# EAGLE board BLE_POV_Display_v2.1 (EAGLE 9.6.2)
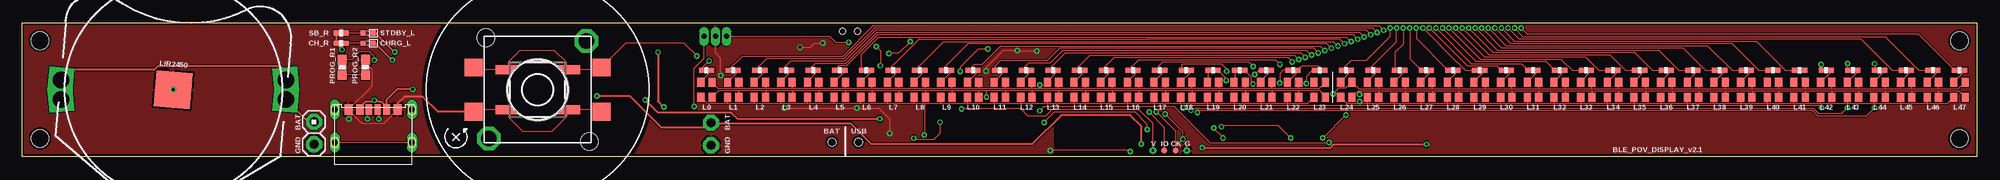
[diagram p2: board, top side]
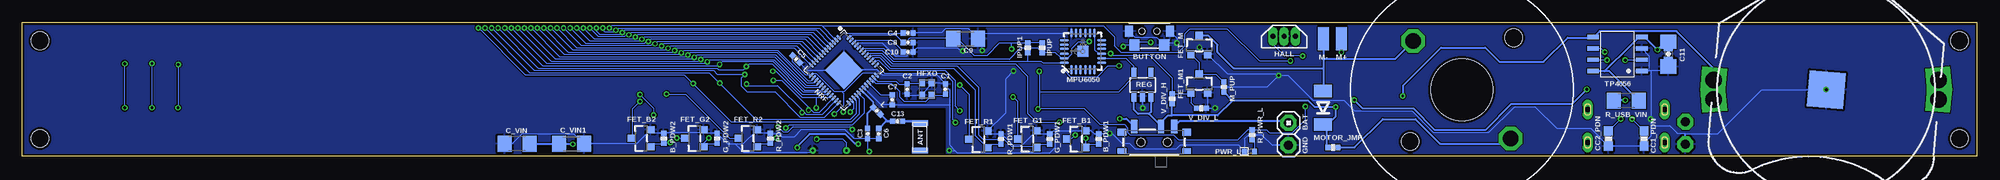
[diagram p3: board, bottom side, seen from below]

Size 220 x 15 mm. Coordinates in mm from the lower left corner, seen from the top.
Outline: 220,0 220,15 0,15 0,0 220,0
Copper layers (1*16): Top 0.035mm / dielectric 1.5mm / Bottom 0.035mm
Design rules "SeeedStudio_2layer_DRU_no_angle_20140221 *": minimum track width 5mil, minimum drill 12mil, track to track 5mil, track to pad 5mil, pad to pad 5mil, via to via 5mil, smd to smd 0mil, copper to edge 10mil, drill to drill 10mil, minimum pad ring 10mil, minimum via ring 6mil, stop-mask expansion 2mil, vias tented up to drill 100mil, thermal gap 10mil
Net classes: 1 pwr: width 0.203 mm
Holes 2 mm at 218,2 218,13 2,13 2,2
tRestrict: area 116.1,0.1 to 126.3,5.4; area 51,0.5 to 65,14.5
bRestrict: area 116.2,0.1 to 126.3,5.4

## Footprints (pad centres in the part's own frame; a part is rotated, then mirrored left to right if it is on the bottom)
CR2477_PTH = smd 4.064 x 4.064: GND 0,0 | drill 1.854 square: V+1 -12.7,0; V+2 12.7,0
ANT3216LL00R2400A = smd 1.8 x 0.6: P1 0,1.55; P2 0,-1.55
0402-RES = smd 0.6 x 0.6: 1 -0.55,0; 2 0.55,0
1X02 = drill 1.016 pad 1.778 octagon: 1 -1.27,0; 2 1.27,0
2X4X3.5MM = smd 1.15 x 1.3: 1 -1.675,-1.55; 2 1.675,-1.55 | smd 0.9 x 1.2: GND -2.3,0; GND2 2.3,0 | hole 0.7: -0.85,0; 0.85,0
0402-CAP = smd 0.6 x 0.6: 1 -0.55,0; 2 0.55,0
1206 = smd 1.6 x 1.8: 1 -1.4,0; 2 1.4,0
0603|1206 = smd 1.1 x 1: 1 -0.85,0; 2 0.85,0 | smd 1.6 x 1.8: P$1 -1.4,0; P$2 1.4,0
0603-RES = smd 1.1 x 1: 1 -0.85,0; 2 0.85,0
0402 = smd 0.6 x 0.6: A -0.55,0; C 0.55,0
SOT23-3 = smd 0.8 x 0.9: 1 -0.95,-1; 2 0.95,-1; 3 0,1.1
TO92_HALLSENSOR = drill 0.55 pad 1.016 long: GND 0,0; OUT -1.27,0; VCC 1.27,0
XTAL_CX2016DB16000D0WZRC1 = smd 0.8 x 0.7: 1 -0.7,-0.55; 2 0.7,-0.55; 3 0.7,0.55; 4 -0.7,0.55
0402' = smd 0.6 x 0.6: 1 -0.55,0; 2 0.55,0
0606 = smd 1 x 0.8: 1 -0.85,0.635; 2 0.85,0.635; 3 0.85,-0.635; 4 -0.85,-0.635
PAD_50X100MIL = smd 1.27 x 2.54: P$1 0,0
QFN-24-EP = smd 1.016 x 0.254: 1 -2.066,1.257; 2 -2.066,0.75; 3 -2.066,0.247; 4 -2.066,-0.287; 5 -2.066,-0.792; 6 -2.066,-1.297; 13 2.086,-1.297; 14 2.086,-0.792; 15 2.086,-0.287; 16 2.086,0.247; 17 2.086,0.75; 18 2.086,1.257 | smd 0.254 x 1.016: 7 -1.267,-2.122; 8 -0.762,-2.122; 9 -0.258,-2.122; 10 0.278,-2.122; 11 0.78,-2.122; 12 1.287,-2.122; 19 1.287,2.082; 20 0.78,2.082; 21 0.278,2.082; 22 -0.258,2.082; 23 -0.762,2.082; 24 -1.267,2.082 | smd 1.27 x 1.27: P$1 0.02,-0.01
NRF52810_QFN40P600X600X90-48_N_3MMTHERMAL = smd 0.65 x 0.2: 1 -3,2.2; 2 -3,1.8; 3 -3,1.4; 4 -3,1; 5 -3,0.6; 6 -3,0.2; 7 -3,-0.2; 8 -3,-0.6; 9 -3,-1; 10 -3,-1.4; 11 -3,-1.8; 12 -3,-2.2; 25 3,-2.2; 26 3,-1.8; 27 3,-1.4; 28 3,-1; 29 3,-0.6; 30 3,-0.2; 31 3,0.2; 32 3,0.6; 33 3,1; 34 3,1.4; 35 3,1.8; 36 3,2.2 | smd 0.2 x 0.65: 13 -2.2,-3; 14 -1.8,-3; 15 -1.4,-3; 16 -1,-3; 17 -0.6,-3; 18 -0.2,-3; 19 0.2,-3; 20 0.6,-3; 21 1,-3; 22 1.4,-3; 23 1.8,-3; 24 2.2,-3; 37 2.2,3; 38 1.8,3; 39 1.4,3; 40 1,3; 41 0.6,3; 42 0.2,3; 43 -0.2,3; 44 -0.6,3; 45 -1,3; 46 -1.4,3; 47 -1.8,3; 48 -2.2,3 | smd 3 x 3: PAD 0,0
SOT23-5 = smd 0.55 x 1.2: 1 -0.95,-1.3; 2 0,-1.3; 3 0.95,-1.3; 4 0.95,1.3; 5 -0.95,1.3
12X12MM_SMD_BT = smd 2 x 2: P$1 -7.2,2.5; P$2 7.2,2.5; P$3 -7.2,-2.5; P$4 7.2,-2.5
DTS-6_SMD = smd 3 x 1: 1 -3.25,2.25; 2 3.25,2.25; 3 -3.25,-2.25; 4 3.25,-2.25
SOP8 = smd 1.3 x 0.5: P$1 -2.75,1.905; P$2 -2.75,0.635; P$3 -2.75,-0.635; P$4 -2.75,-1.905; P$5 2.75,-1.905; P$6 2.75,-0.635; P$7 2.75,0.635; P$8 2.75,1.905
GV_SWD_1.27MM_4P_SEMI_SMD = drill 0.25 pad 0.7: GND 1.905,0; VCC -1.905,0 | smd 0.7 x 0.7: SWDCLK 0.635,0; SWDIO -0.635,0
SOD-80 = smd 1.4 x 2: + 1.87,0; - -1.87,0
SMD_SWITCH = smd 0.7 x 1.5: 1 -2.25,-1.75; 2 -0.75,-1.75; 3 2.25,-1.75 | smd 1 x 0.6: GND1 -3.65,1; GND3 3.65,1 | smd 1 x 0.8: GND2 -3.65,-1.1; GND4 3.65,-1.1 | hole 0.9: -1.5,0; 1.5,0
USCX-06FX-XXMX-01 = smd 0.7 x 1.2: CC1 0.5,-1.75; CC2 -0.5,-1.75 | smd 0.9 x 1.2: GND1 2.75,-1.75; GND2 -2.75,-1.75 | drill 0.6 long: SHIELD1 4.325,1.95; SHIELD2 4.325,-1.75; SHIELD3 -4.35,-1.75; SHIELD4 -4.35,1.95 | smd 0.8 x 1.2: VBUS1 1.5,-1.75; VBUS2 -1.5,-1.75
MOTOR-24.5_HOLES = hole 7: 0,0 | hole 2: -8.25,0; 8.25,0
MOTOR-24.5X12.3 = drill 1.75 pad 2.5 octagon: + -7.75,0; - 7.75,0 | hole 7: 0,0

## Placement (x,y rotation side)
1  CR2477  [CR2477_PTH]  17,7.5 175 bottom
ANT  ANT3216LL00R2400A  [ANT3216LL00R2400A]  119,2.19 0 bottom
B_PDW1  100k  [0402-RES]  98.86,1.95 90 bottom
B_PDW2  100k  [0402-RES]  147.82,2.03 90 bottom
BAT1  PINH1X02  [1X02]  77.5,2.5 90 bottom
BAT2  PINH1X02  [1X02]  32.84,2.61 90 top
BUTTON  PUSHBUTTON_2X4X3.5  [2X4X3.5MM]  93.16,14.07 0 bottom
C1  12pF  [0402-CAP]  116.11,7.57 270 bottom
C2  12pF  [0402-CAP]  120.43,7.57 90 bottom
C3  0.5pF  [0402-CAP]  124.87,2.57 270 bottom
C4  100nF  [0402-CAP]  120.3,13.87 0 bottom
C5  100nF  [0402-CAP]  132.91,10.94 315 bottom
C6  0.5pF  [0402-CAP]  123.6,2.57 270 bottom
C7  100pF  [0402-CAP]  122.09,6.35 90 bottom
C8  100nF  [0402-CAP]  120.3,12.8 180 bottom
C9  4.7uF  [1206]  113.84,13.24 0 bottom
C10  1uF  [0402-CAP]  120.3,11.73 180 bottom
C11  [0603|1206]  34.75,11.5 270 bottom
C13  18pF  [0402-CAP]  121.49,3.95 0 bottom
C_VIN  100uF  [1206]  164.3,1.39 180 bottom
C_VIN1  100uF  [1206]  158.18,1.39 0 bottom
CC1_PDN  [0603-RES]  37.5,2 90 bottom
CC2_PDN  [0603-RES]  41.5,2 90 bottom
CH_R  1k  [0402-RES]  35.89,12.72 0 top
CHRG_L  LED_0402  [0402]  38.91,12.72 0 top
FET_B1  AO3400  [SOT23-3]  101.36,1.95 90 bottom
FET_B2  AO3400  [SOT23-3]  150.32,2.03 90 bottom
FET_G1  AO3400  [SOT23-3]  106.86,1.95 90 bottom
FET_G2  AO3400  [SOT23-3]  144.32,2.03 90 bottom
FET_M  AO3400  [SOT23-3]  87.55,12.47 0 bottom
FET_M1  AO3400  [SOT23-3]  87.55,8.15 0 bottom
FET_R1  AO3400  [SOT23-3]  112.37,1.9 90 bottom
FET_R2  AO3400  [SOT23-3]  138.32,2.03 90 bottom
G_PDW1  100k  [0402-RES]  104.36,1.95 90 bottom
G_PDW2  100k  [0402-RES]  141.82,2.03 90 bottom
HALL  49E  [TO92_HALLSENSOR]  78,13.5 0 bottom
HFXO  32MHz  [XTAL_CX2016DB16000D0WZRC1]  118.19,7.57 270 bottom
IPUP  100k  [0402-RES]  105.23,12.22 270 bottom
IPUP1  100k  [0402-RES]  106.86,12.22 270 bottom
L  3.9nH  [0402']  123.83,5.12 315 bottom
L0  RGB_LED_ANODE_(+)_0606_LARGE_FOOTPRINT  [0606]  77,7.5 90 top
L1  RGB_LED_ANODE_(+)_0606_LARGE_FOOTPRINT  [0606]  80,7.5 90 top
L2  RGB_LED_ANODE_(+)_0606_LARGE_FOOTPRINT  [0606]  83,7.5 90 top
L3  RGB_LED_ANODE_(+)_0606_LARGE_FOOTPRINT  [0606]  86,7.5 90 top
L4  RGB_LED_ANODE_(+)_0606_LARGE_FOOTPRINT  [0606]  89,7.5 90 top
L5  RGB_LED_ANODE_(+)_0606_LARGE_FOOTPRINT  [0606]  92,7.5 90 top
L6  RGB_LED_ANODE_(+)_0606_LARGE_FOOTPRINT  [0606]  95,7.5 90 top
L7  RGB_LED_ANODE_(+)_0606_LARGE_FOOTPRINT  [0606]  98,7.5 90 top
L8  RGB_LED_ANODE_(+)_0606_LARGE_FOOTPRINT  [0606]  101,7.5 90 top
L9  RGB_LED_ANODE_(+)_0606_LARGE_FOOTPRINT  [0606]  104,7.5 90 top
L10  RGB_LED_ANODE_(+)_0606_LARGE_FOOTPRINT  [0606]  107,7.5 90 top
L11  RGB_LED_ANODE_(+)_0606_LARGE_FOOTPRINT  [0606]  110,7.5 90 top
L12  RGB_LED_ANODE_(+)_0606_LARGE_FOOTPRINT  [0606]  113,7.5 90 top
L13  RGB_LED_ANODE_(+)_0606_LARGE_FOOTPRINT  [0606]  116,7.5 90 top
L14  RGB_LED_ANODE_(+)_0606_LARGE_FOOTPRINT  [0606]  119,7.5 90 top
L15  RGB_LED_ANODE_(+)_0606_LARGE_FOOTPRINT  [0606]  122,7.5 90 top
L16  RGB_LED_ANODE_(+)_0606_LARGE_FOOTPRINT  [0606]  125,7.5 90 top
L17  RGB_LED_ANODE_(+)_0606_LARGE_FOOTPRINT  [0606]  128,7.5 90 top
L18  RGB_LED_ANODE_(+)_0606_LARGE_FOOTPRINT  [0606]  131,7.5 90 top
L19  RGB_LED_ANODE_(+)_0606_LARGE_FOOTPRINT  [0606]  134,7.5 90 top
L20  RGB_LED_ANODE_(+)_0606_LARGE_FOOTPRINT  [0606]  137,7.5 90 top
L21  RGB_LED_ANODE_(+)_0606_LARGE_FOOTPRINT  [0606]  140,7.5 90 top
L22  RGB_LED_ANODE_(+)_0606_LARGE_FOOTPRINT  [0606]  143,7.5 90 top
L23  RGB_LED_ANODE_(+)_0606_LARGE_FOOTPRINT  [0606]  146,7.5 90 top
L24  RGB_LED_ANODE_(+)_0606_LARGE_FOOTPRINT  [0606]  149,7.5 90 top
L25  RGB_LED_ANODE_(+)_0606_LARGE_FOOTPRINT  [0606]  152,7.5 90 top
L26  RGB_LED_ANODE_(+)_0606_LARGE_FOOTPRINT  [0606]  155,7.5 90 top
L27  RGB_LED_ANODE_(+)_0606_LARGE_FOOTPRINT  [0606]  158,7.5 90 top
L28  RGB_LED_ANODE_(+)_0606_LARGE_FOOTPRINT  [0606]  161,7.5 90 top
L29  RGB_LED_ANODE_(+)_0606_LARGE_FOOTPRINT  [0606]  164,7.5 90 top
L30  RGB_LED_ANODE_(+)_0606_LARGE_FOOTPRINT  [0606]  167,7.5 90 top
L31  RGB_LED_ANODE_(+)_0606_LARGE_FOOTPRINT  [0606]  170,7.5 90 top
L32  RGB_LED_ANODE_(+)_0606_LARGE_FOOTPRINT  [0606]  173,7.5 90 top
L33  RGB_LED_ANODE_(+)_0606_LARGE_FOOTPRINT  [0606]  176,7.5 90 top
L34  RGB_LED_ANODE_(+)_0606_LARGE_FOOTPRINT  [0606]  179,7.5 90 top
L35  RGB_LED_ANODE_(+)_0606_LARGE_FOOTPRINT  [0606]  182,7.5 90 top
L36  RGB_LED_ANODE_(+)_0606_LARGE_FOOTPRINT  [0606]  185,7.5 90 top
L37  RGB_LED_ANODE_(+)_0606_LARGE_FOOTPRINT  [0606]  188,7.5 90 top
L38  RGB_LED_ANODE_(+)_0606_LARGE_FOOTPRINT  [0606]  191,7.5 90 top
L39  RGB_LED_ANODE_(+)_0606_LARGE_FOOTPRINT  [0606]  194,7.5 90 top
L40  RGB_LED_ANODE_(+)_0606_LARGE_FOOTPRINT  [0606]  197,7.5 90 top
L41  RGB_LED_ANODE_(+)_0606_LARGE_FOOTPRINT  [0606]  200,7.5 90 top
L42  RGB_LED_ANODE_(+)_0606_LARGE_FOOTPRINT  [0606]  203,7.5 90 top
L43  RGB_LED_ANODE_(+)_0606_LARGE_FOOTPRINT  [0606]  206,7.5 90 top
L44  RGB_LED_ANODE_(+)_0606_LARGE_FOOTPRINT  [0606]  209,7.5 90 top
L45  RGB_LED_ANODE_(+)_0606_LARGE_FOOTPRINT  [0606]  212,7.5 90 top
L46  RGB_LED_ANODE_(+)_0606_LARGE_FOOTPRINT  [0606]  215,7.5 90 top
L47  RGB_LED_ANODE_(+)_0606_LARGE_FOOTPRINT  [0606]  218,7.5 90 top
LIR2450  CR2477  [CR2477_PTH]  17,7.5 355 top
M+  PAD_50X100MIL  [PAD_50X100MIL]  71.55,13.23 0 bottom
M-  PAD_50X100MIL  [PAD_50X100MIL]  73.58,13.23 0 bottom
M_PUP  100k  [0402-RES]  84.77,7.79 270 bottom
MOTOR_JMP  0  [0402-RES]  72.5,1 180 bottom
MPU6050  MPU-6000  [QFN-24-EP]  100.65,11.8 90 bottom
NRF  NORDIC_NRF_NRF52810_QF  [NRF52810_QFN40P600X600X90-48_N_3MMTHERMAL]  127.55,9.69 315 bottom
PROG_R1  10k  [0603-RES]  36,10 270 top
PROG_R2  10k  [0603-RES]  38.62,10 90 top
PWR_L  LED_0402  [0402]  81.89,0.56 180 bottom
R0  220  [0402-RES]  77,9.68 0 top
R1  220  [0402-RES]  80,9.68 0 top
R2  220  [0402-RES]  83,9.68 0 top
R3  220  [0402-RES]  86,9.68 0 top
R4  220  [0402-RES]  89,9.68 0 top
R5  220  [0402-RES]  92,9.68 0 top
R6  220  [0402-RES]  95,9.68 0 top
R7  220  [0402-RES]  98,9.68 0 top
R8  220  [0402-RES]  101,9.68 0 top
R9  220  [0402-RES]  104,9.68 0 top
R10  220  [0402-RES]  107,9.68 0 top
R11  220  [0402-RES]  110,9.68 0 top
R12  220  [0402-RES]  113,9.68 0 top
R13  220  [0402-RES]  116,9.68 0 top
R14  220  [0402-RES]  119,9.68 0 top
R15  220  [0402-RES]  122,9.68 0 top
R16  220  [0402-RES]  125,9.68 0 top
R17  220  [0402-RES]  128,9.68 0 top
R18  220  [0402-RES]  131,9.68 0 top
R19  220  [0402-RES]  134,9.68 180 top
R20  220  [0402-RES]  137,9.68 180 top
R21  220  [0402-RES]  140,9.68 0 top
R22  220  [0402-RES]  143,9.68 0 top
R23  220  [0402-RES]  146,9.68 0 top
R24  220  [0402-RES]  149,9.68 0 top
R25  220  [0402-RES]  152,9.68 0 top
R26  220  [0402-RES]  155,9.68 0 top
R27  220  [0402-RES]  158,9.68 0 top
R28  220  [0402-RES]  161,9.68 0 top
R29  220  [0402-RES]  164,9.68 0 top
R30  220  [0402-RES]  167,9.68 0 top
R31  220  [0402-RES]  170,9.68 0 top
R32  220  [0402-RES]  173,9.68 0 top
R33  220  [0402-RES]  176,9.68 0 top
R34  220  [0402-RES]  179,9.68 0 top
R35  220  [0402-RES]  182,9.68 0 top
R36  220  [0402-RES]  185,9.68 0 top
R37  220  [0402-RES]  188,9.68 0 top
R38  220  [0402-RES]  191,9.68 0 top
R39  220  [0402-RES]  194,9.68 0 top
R40  220  [0402-RES]  197,9.68 0 top
R41  220  [0402-RES]  200,9.68 0 top
R42  220  [0402-RES]  203,9.68 0 top
R43  220  [0402-RES]  206,9.68 0 top
R44  220  [0402-RES]  209,9.68 0 top
R45  220  [0402-RES]  212,9.68 0 top
R46  220  [0402-RES]  215,9.68 0 top
R47  220  [0402-RES]  218,9.68 0 top
R_PDW1  100k  [0402-RES]  109.86,1.95 90 bottom
R_PDW2  100k  [0402-RES]  135.82,2.03 90 bottom
R_PWR_L  10k  [0402-RES]  81.58,2.42 270 bottom
R_USB_VIN  [1206]  39.5,6.25 180 bottom
REG  MIC5219-BM5  [SOT23-5]  93.93,8.04 0 bottom
S1  BT_4_PIN_12X12MM_SMD  [12X12MM_SMD_BT]  58,7.5 0 top
S2  BT_4_PINSMD  [DTS-6_SMD]  58,7.5 0 top
SB_R  1k  [0402-RES]  35.89,13.87 0 top
STDBY_L  LED_0402  [0402]  38.91,13.87 0 top
TP4056  TP4056_SOP8  [SOP8]  40.5,11.5 180 bottom
U$2  GV_SWD_4P  [GV_SWD_1.27MM_4P_SEMI_SMD]  129.14,0.65 0 top
U$7  [GV_5MM_METAL]  184,3 0 top
U$11  LL4148-GS18  [SOD-80]  73.62,5.46 90 bottom
U$16  SMD_SWITCH  [SMD_SWITCH]  92.61,1.6 180 bottom
U$19  USB-C_6PIN  [USCX-06FX-XXMX-01]  39.5,3.5 180 top
U$20  [MOTOR-24.5_HOLES]  58,7.5 135 top
U$22  MOTOR-24.5X12.3  [MOTOR-24.5X12.3]  58,7.5 45 top
V_DIV_H  100k  [0402-RES]  90.59,6.47 90 bottom
V_DIV_L  200k  [0402-RES]  87.32,5.41 180 bottom

## Tracks (layer width: path | path; a pad name or v marks a point on that pad's centre or on a via)
3V3  (via drill 0.3, 0.3 pad 0.5)
  Top 0.127: v75.61,5.6 75.61,9.9 76.73,11.02 HALL.VCC | v108.67,12.06 107.57,12.06 105.55,10.04 v105.55,9.56 | U$2.VCC 127.23,3.71 125.69,5.26 115.86,5.26 115.14,4.53 113.2,4.53 112.4,5.33 v105.7,5.33 | v130.6,1.93 130.6,2.77 128.62,4.75 v128.6,4.75
  Bottom 0.127: C5.1 133.3,10.64 131.8,9.13 NRF.13 131.18,9.17 130.99,9.36 130.67,9.36 128.64,7.33 127.79,7.33 | NRF.48 126.92,13.42 126.79,13.42 126.6,13.61 121.65,13.61 120.89,12.85 C8.2 120.83,12.85 120.57,12.85 120.13,13.3 115.24,13.3 C9.1 114.78,13.24 112.92,11.39 111.39,11.39 110.01,12.77 108.67,12.77 | 108.67,12.77 IPUP1.1 IPUP.1 | 127.79,7.33 127.49,7.33 125.46,9.36 124.1,9.36 NRF.36 | MPU6050.13 99.3,13.87 99.3,11.96 98.86,11.52 98.6,11.52 MPU6050.9 98.54,11.52 98.54,11.07 MPU6050.8 98.49,10.99 95.74,10.99 94.88,10.13 REG.5 94.88,8.99 96.57,7.29 105.55,7.29 | v75.61,5.6 75.61,4.09 77.08,2.63 79.67,2.63 80.01,2.97 R_PWR_L.1 82.09,2.97 83.2,1.85 89.86,1.85 90.38,2.37 95.3,2.37 95.57,2.64 95.57,3.18 95.92,3.53 98.64,3.53 100.44,5.33 105.69,5.33 | v105.7,5.33 105.69,5.33 | 127.79,7.33 127.58,7.12 127.58,5.76 v128.6,4.75 | v130.6,1.93 127.66,1.93 127.23,1.5 U$2.VCC | 105.69,5.33 105.55,5.47 105.55,7.29 | v105.55,9.56 105.55,7.29 | v108.67,12.06 108.67,12.77
BAT  (via drill 0.3)
  Top 0.203: 1.V+1 4.49,5.36 4.49,9.68 LIR2450.V+1 4.56,9.74 14.84,9.74 15.23,10.12 29.07,10.12 29.45,9.74 1.V+2 | v158.04,1.36 147.62,1.36 147.24,0.98 v132.78,0.98 | v64.67,6.78 68.38,6.78 71.93,3.22 76.95,3.22 BAT1.2 77.52,3.71 93.2,3.71 95.52,1.4 113.69,1.4 116.94,4.65 124.66,4.65 125.93,3.38 v125.93,1.4 | BAT2.2 32.16,3.88 LIR2450.V+2
  Bottom 0.203: LIR2450.V+2 29.62,6.43 29.62,8.57 1.V+2 29.51,9.74 33.86,14.08 42.47,14.08 43.13,13.42 43.23,13.42 TP4056.P$5 43.29,13.36 46.07,13.36 48.82,10.62 53.77,10.62 55.37,12.22 60.35,12.22 64.62,7.95 64.62,6.83 v64.67,6.78 | C_VIN.1 162.86,1.42 159.62,1.42 C_VIN1.1 159.5,1.36 v158.04,1.36 | U$16.1 89.72,3.99 77.72,3.99 BAT1.2 | v132.78,0.98 132.78,1.15 131.43,2.5 127.37,2.5 126.26,1.4 v125.93,1.4
BLUE1  (via drill 0.3)
  Top 0.127: L0.1 77.06,5.96 79.36,5.96 | L23.1 144.67,5.96 142.35,5.96 | 79.36,5.96 82.41,5.96 | 82.41,5.96 85.39,5.96 | 85.39,5.96 88.38,5.96 | 88.38,5.96 91.36,5.96 | 91.36,5.96 92.02,5.96 | 92.02,5.96 94.35,5.96 | 94.35,5.96 97.39,5.96 | 97.39,5.96 100.38,5.96 | 100.38,5.96 101.52,5.96 | 101.52,5.96 103.36,5.96 | 103.36,5.96 106.35,5.96 | 106.35,5.96 109.4,5.96 | 109.4,5.96 112.38,5.96 | 112.38,5.96 115.36,5.96 | 115.36,5.96 118.35,5.96 | 118.35,5.96 121.4,5.96 | 121.4,5.96 124.38,5.96 | 124.38,5.96 127.37,5.96 | 127.37,5.96 130.35,5.96 | 130.35,5.96 133.4,5.96 | 133.4,5.96 136.38,5.96 | 136.38,5.96 139.37,5.96 | 139.37,5.96 142.35,5.96 | 101.52,5.96 v101.52,2.39 | 79.36,5.96 79.36,6.63 L1.1 | 82.41,5.96 82.41,6.63 L2.1 | 85.39,5.96 85.39,6.63 L3.1 | 88.38,5.96 88.38,6.63 L4.1 | 91.36,5.96 91.36,6.63 L5.1 | 94.35,5.96 94.35,6.63 L6.1 | 97.39,5.96 97.39,6.63 L7.1 | 100.38,5.96 100.38,6.63 L8.1 | 103.36,5.96 103.36,6.63 L9.1 | 106.35,5.96 106.35,6.63 L10.1 | 109.4,5.96 109.4,6.63 L11.1 | 112.38,5.96 112.38,6.63 L12.1 | 115.36,5.96 L13.1 | 118.35,5.96 118.35,6.63 L14.1 | 121.4,5.96 121.4,6.63 L15.1 | 124.38,5.96 124.38,6.63 L16.1 | 127.37,5.96 127.37,6.63 L17.1 | 130.35,5.96 130.35,6.63 L18.1 | 133.4,5.96 133.4,6.63 L19.1 | 136.38,5.96 136.38,6.63 L20.1 | 139.37,5.96 139.37,6.63 L21.1 | 142.35,5.96 142.35,6.63 L22.1 | 92.02,5.96
  Bottom 0.127: v101.52,2.39 101.9,2 102.41,2 FET_B1.3
BLUE2  (via drill 0.3)
  Top 0.127: L24.1 149.06,5.96 150.48,5.96 | L47.1 216.67,5.96 214.36,5.96 | 150.48,5.96 151.37,5.96 | 151.37,5.96 154.35,5.96 | 154.35,5.96 157.4,5.96 | 157.4,5.96 160.39,5.96 | 160.39,5.96 163.37,5.96 | 163.37,5.96 166.36,5.96 | 166.36,5.96 169.4,5.96 | 169.4,5.96 172.39,5.96 | 172.39,5.96 175.37,5.96 | 175.37,5.96 178.36,5.96 | 178.36,5.96 181.41,5.96 | 181.41,5.96 184.39,5.96 | 184.39,5.96 187.37,5.96 | 187.37,5.96 190.36,5.96 | 190.36,5.96 193.41,5.96 | 193.41,5.96 196.39,5.96 | 196.39,5.96 199.38,5.96 | 199.38,5.96 202.36,5.96 | 202.36,5.96 205.41,5.96 | 205.41,5.96 208.39,5.96 | 208.39,5.96 211.38,5.96 | 211.38,5.96 214.36,5.96 | 150.48,5.96 v150.48,6.18 | 151.37,5.96 151.37,6.63 L25.1 | 154.35,5.96 154.35,6.63 L26.1 | 157.4,5.96 157.4,6.63 L27.1 | 160.39,5.96 160.39,6.63 L28.1 | 163.37,5.96 163.37,6.63 L29.1 | 166.36,5.96 166.36,6.63 L30.1 | 169.4,5.96 169.4,6.63 L31.1 | 172.39,5.96 172.39,6.63 L32.1 | 175.37,5.96 175.37,6.63 L33.1 | 178.36,5.96 178.36,6.63 L34.1 | 181.41,5.96 181.41,6.63 L35.1 | 184.39,5.96 184.39,6.63 L36.1 | 187.37,5.96 187.37,6.63 L37.1 | 190.36,5.96 190.36,6.63 L38.1 | 193.41,5.96 193.41,6.63 L39.1 | 196.39,5.96 196.39,6.63 L40.1 | 199.38,5.96 199.38,6.63 L41.1 | 202.36,5.96 202.36,6.63 L42.1 | 205.41,5.96 205.41,6.63 L43.1 | 208.39,5.96 208.39,6.63 L44.1 | 211.38,5.96 211.38,6.63 L45.1 | 214.36,5.96 214.36,6.63 L46.1
  Bottom 0.127: v150.48,6.18 151.37,5.29 151.37,2.06 FET_B2.3
BLUE_S1  (via drill 0.3 pad 0.5)
  Top 0.127: v100.33,2.03 100.33,2.02 100.45,1.89 102.56,1.89 103.28,2.6 v103.28,3.83
  Bottom 0.127: 100.32,1.05 100.33,1.04 v100.33,2.03 | 100.32,1.05 100,1.37 98.92,1.37 B_PDW1.1 | 100.32,1.05 FET_B1.1 | NRF.41 124.78,11.61 123.26,11.61 122.07,10.41 108.25,10.41 106.86,9.02 106.86,4.85 105.84,3.83 v103.28,3.83
BLUE_S2  (via drill 0.3, 0.3 pad 0.5)
  Top 0.127: v147.05,1.55 133.68,1.55 129.6,5.62 126.06,5.62 126.04,5.61 114.98,5.61 v114.5,5.13
  Bottom 0.127: FET_B2.1 149.27,1.1 148.96,1.42 147.88,1.42 B_PDW2.1 147.75,1.55 v147.05,1.55 | v114.5,5.13 115.03,5.66 115.03,8.58 116.08,9.62 122.43,9.62 123.56,10.76 123.81,10.76 124,10.56 124.13,10.56 NRF.38
CHARGER_VIN  (via drill 0.3)
  Top 0.203: SB_R.1 CH_R.1 36,12.07 v36,11.99
  Bottom 0.203: 41.95,9.55 41.39,9.55 38.15,6.31 R_USB_VIN.1 | 41.95,9.55 43.23,9.55 TP4056.P$8 | 41.95,9.55 39.01,12.49 38.09,13.4 TP4056.P$4 37.41,13.4 v36,11.99 35.08,12.9 C11.P$1 C11.1
FET_M||SCL  (via drill 0.3)
  Top 0.127: v97.53,11.58 98.6,11.58 v99.93,12.91
  Bottom 0.127: NRF.43 125.53,11.96 125.33,12.15 123.09,12.15 121.89,10.95 108.9,10.95 107.64,12.2 105.77,12.2 IPUP.2 103.7,11.67 103.11,11.07 102.79,11.07 MPU6050.23 102.73,11.07 102.35,11.07 101.88,11.54 101.88,12.18 101.14,12.91 v99.93,12.91 | v97.53,11.58 97.53,11.56 97.37,11.39 93.17,11.39 90.59,8.81 V_DIV_H.2 88.59,7.02 88.5,7.11 | FET_M1.1 88.5,7.11 | 88.5,7.11 88.5,6.04 V_DIV_L.2
GND  (via drill 0.3, 0.3 pad 0.5)
  Top 0.127: PROG_R2.2 38.66,10.82 38.66,10.44 39.35,9.74 39.35,7.9 36.75,5.29 U$19.GND1 | U$19.GND2 42.21,5.23 41.64,4.66 41.64,4.6 40.75,3.71 38.21,3.71 36.69,5.23 U$19.GND1 | v36.75,4.21 37.2,4.66 U$19.GND1 | v108.46,9.61 108.44,9.62 108.44,9.97 110.37,11.9 v111.97,11.9 112.01,11.86 v114.17,11.86 | v78.6,9.1 78.6,11.05 78,11.65 HALL.GND | v90.07,12.75 89.18,12.75 88.69,12.27 v87.53,12.27 | v124.69,0.56 124.59,0.66 v115.69,0.66 | v97.61,2.59 97.61,4.21 96.39,5.43 v93.93,5.43 v85.77,5.43 | S1.P$3 51.05,5.25 S2.3 54.75,4.38 56.31,2.82 59.61,2.82 61.25,4.46 S2.4 64.95,5.25 S1.P$4
  Top 0.203: S1.P$3 46.79,5 45.06,6.73 43.03,6.73 42.25,5.95 U$19.GND2
  Bottom 0.127: C5.2 131.66,9.69 NRF.PAD 127.43,9.74 123.78,9.74 123.16,9.12 117.03,9.12 116.19,8.28 116.12,8.13 | 116.12,8.13 C1.1 116.06,8.09 116.06,7.9 115.62,7.45 115.62,5.76 | C2.1 120.38,7.01 120.25,6.88 118.79,6.88 HFXO.2 118.79,6.95 117.65,8.09 117.65,8.22 HFXO.4 116.25,8.27 116.12,8.13 | C6.2 124.84,2.02 | NRF.31 123.43,5.87 122.1,5.87 C7.1 115.66,5.8 115.62,5.76 | 139.77,1.42 140.64,1.42 141.78,2.56 G_PDW2.2 141.84,2.63 142.99,2.63 143.31,2.95 FET_G2.2 143.37,2.95 143.69,2.63 147.81,2.63 B_PDW2.2 147.88,2.63 148.96,2.63 149.27,2.95 FET_B2.2 149.34,2.95 150.86,1.42 156.77,1.42 C_VIN1.2 156.83,1.42 157.91,2.5 163.81,2.5 164.9,1.42 165.66,1.42 C_VIN.2 | 139.77,1.42 138.86,1.42 137.34,2.95 FET_R2.2 137.27,2.95 136.96,2.63 135.88,2.63 R_PDW2.2 135.81,2.56 134.86,2.56 134.52,2.23 133.09,2.23 132.28,3.04 127.45,3.04 126.42,2.02 C3.2 124.84,2.02 | C11.P$2 34.78,10.12 34.78,10.63 C11.2 34.85,10.12 35.35,9.61 36.75,9.61 | 36.75,9.61 36.88,9.61 | 36.88,9.61 37.7,9.61 TP4056.P$1 | 36.88,9.61 36.88,11.26 37.7,12.09 TP4056.P$3 | 36.75,9.61 v36.75,4.21 36.75,3.45 | 36.75,3.45 36.75,2.25 37.51,1.48 37.51,1.23 CC1_PDN.1 37.51,1.17 41.45,1.17 CC2_PDN.1 43.5,3.15 47.32,3.15 49.77,5.6 52.03,5.6 54.94,2.69 61.19,2.69 63.6,5.1 70.06,5.1 71.25,6.29 74.76,6.29 77.58,9.1 v78.6,9.1 | 36.75,3.45 34.59,3.45 33.68,2.54 32.87,2.54 29.22,2.54 24.31,7.45 17.05,7.45 1.GND | C4.2 119.75,13.93 116.57,13.93 116.13,14.38 113.52,14.38 112.44,13.3 C9.2 | MPU6050.18 101.97,13.87 111.81,13.87 112.38,13.3 C9.2 | C10.1 119.75,11.77 119.75,12.79 C8.1 | 115,0.6 114.74,0.35 104.42,0.35 103.72,1.04 103.72,2.83 103.66,2.89
  Bottom 0.127: 115,0.6 115.62,1.22 115.62,5.76 | C10.1 119.34,12.15 114.69,12.15 114.4,11.86 v114.17,11.86 | 103.66,2.89 103.96,2.89 G_PDW1.2 104.38,2.51 105.46,2.51 105.84,2.89 FET_G1.2 105.86,2.88 107.41,1.32 108.55,1.32 109.73,2.5 R_PDW1.2 109.9,2.51 111.05,2.51 111.36,2.83 FET_R1.2 109.37,4.85 109.37,8.7 v108.46,9.61 | 103.66,2.89 100.38,2.89 FET_B1.2 100.34,2.92 99.77,2.92 99.36,2.51 98.92,2.51 B_PDW1.2 98.79,2.51 98.72,2.59 v97.61,2.59 97.36,2.59 96.2,1.43 95.36,1.43 94.72,0.79 90.16,0.79 89.71,1.23 83.11,1.23 PWR_L.C 82.44,1.98 81.97,2.45 80.55,2.45 79.33,1.23 BAT1.1 | v111.97,11.9 111.97,13.14 C9.2 | BUTTON.GND2 90.07,13.28 v90.07,12.75 91.26,12.75 BUTTON.2 92.37,13.4 94.79,13.4 BUTTON.GND | 115,0.6 115.63,0.6 v115.69,0.66 | v124.69,0.56 124.84,0.71 124.84,2.02 | C10.1 119.98,11.73 120.47,11.24 121.71,11.24 123.22,12.75 125.9,12.75 NRF.45 | REG.2 v93.93,5.43 | U$2.GND 131.21,0.48 138.84,0.48 139.77,1.42 | v78.6,9.1 79.91,7.8 86.08,7.8 86.6,7.27 FET_M1.2 86.6,5.58 V_DIV_L.1 85.8,5.41 v85.77,5.43 | v78.6,9.1 78.76,9.27 84.4,9.27 FET_M.2 87.4,12.27 v87.53,12.27
  Bottom 0.203: BAT2.1 32.87,1.37 32.87,2.54
  other vias: 17,7.5
  pour Bottom: -4.21,15.42 242.47,15.42 242.47,-0.2 -4.21,-0.2
  pour Top: -1.86,-0.14 -1.86,15.21 245.25,15.21 245.25,-0.14
GREEN1  (via drill 0.3 pad 0.5)
  Top 0.127: L23.4 146.46,6.82 146.06,7.36 143.62,7.36 | 143.62,7.36 140.64,7.36 | 140.64,7.36 137.65,7.36 | 137.65,7.36 134.67,7.36 | 134.67,7.36 131.62,7.36 | 131.62,7.36 128.64,7.36 | 128.64,7.36 125.65,7.36 | 125.65,7.36 122.67,7.36 | 122.67,7.36 119.62,7.36 | 119.62,7.36 116.64,7.36 | 116.64,7.36 113.65,7.36 | 113.65,7.36 110.67,7.36 | 110.67,7.36 108.51,7.36 | 108.51,7.36 107.62,7.36 | 107.62,7.36 104.63,7.36 | 104.63,7.36 101.65,7.36 | 101.65,7.36 98.67,7.36 | 98.67,7.36 95.62,7.36 | 95.62,7.36 92.63,7.36 | 92.63,7.36 89.65,7.36 | 89.65,7.36 86.66,7.36 | 86.66,7.36 83.68,7.36 | 83.68,7.36 80.61,7.36 | 80.61,7.36 78.35,7.36 L0.4 | L1.4 80.63,6.69 80.63,7.33 80.61,7.36 | 83.68,7.36 83.68,6.69 L2.4 | 86.66,7.36 86.66,6.69 L3.4 | 89.65,7.36 89.65,6.69 L4.4 | 92.63,7.36 92.63,6.69 L5.4 | 95.62,7.36 95.62,6.69 L6.4 | 98.67,7.36 98.67,6.69 L7.4 | 101.65,7.36 101.65,6.69 L8.4 | 104.63,7.36 104.63,6.69 L9.4 | 107.62,7.36 107.62,6.69 L10.4 | 110.67,7.36 110.67,6.69 L11.4 | 113.65,7.36 113.65,6.69 L12.4 | 116.64,7.36 L13.4 | 119.62,7.36 119.62,6.69 L14.4 | 122.67,7.36 122.67,6.69 L15.4 | 125.65,7.36 125.65,6.69 L16.4 | 128.64,7.36 128.64,6.69 L17.4 | 131.62,7.36 131.62,6.69 L18.4 | 134.67,7.36 134.67,6.69 L19.4 | 137.65,7.36 137.65,6.69 L20.4 | 140.64,7.36 140.64,6.69 L21.4 | 143.62,7.36 143.62,6.69 L22.4 | v108.51,6.68 108.51,7.36
  Bottom 0.127: FET_G1.3 107.96,6.13 v108.51,6.68
GREEN2  (via drill 0.3)
  Top 0.127: L47.4 217.94,7.34 215.63,7.34 | 150.21,7.22 150.33,7.34 152.64,7.34 | 150.21,7.22 L24.4 | 215.63,7.34 212.65,7.34 | 212.65,7.34 209.66,7.34 | 209.66,7.34 206.68,7.34 | 206.68,7.34 203.63,7.34 | 203.63,7.34 200.65,7.34 | 200.65,7.34 197.66,7.34 | 197.66,7.34 194.68,7.34 | 194.68,7.34 191.63,7.34 | 191.63,7.34 188.64,7.34 | 188.64,7.34 185.66,7.34 | 185.66,7.34 182.68,7.34 | 182.68,7.34 179.63,7.34 | 179.63,7.34 176.64,7.34 | 176.64,7.34 173.66,7.34 | 173.66,7.34 170.67,7.34 | 170.67,7.34 167.62,7.34 | 167.62,7.34 164.64,7.34 | 164.64,7.34 161.66,7.34 | 161.66,7.34 158.67,7.34 | 158.67,7.34 155.62,7.34 | 155.62,7.34 152.64,7.34 | v148.96,4.66 v146.35,2.06 | 150.21,7.22 v150.48,6.95 | 152.64,7.34 152.64,6.69 L25.4 | 155.62,7.34 155.62,6.69 L26.4 | 158.67,7.34 158.67,6.69 L27.4 | 161.66,7.34 161.66,6.69 L28.4 | 164.64,7.34 164.64,6.69 L29.4 | 167.62,7.34 167.62,6.69 L30.4 | 170.67,7.34 170.67,6.69 L31.4 | 173.66,7.34 173.66,6.69 L32.4 | 176.64,7.34 176.64,6.69 L33.4 | 179.63,7.34 179.63,6.69 L34.4 | 182.68,7.34 182.68,6.69 L35.4 | 185.66,7.34 185.66,6.69 L36.4 | 188.64,7.34 188.64,6.69 L37.4 | 191.63,7.34 191.63,6.69 L38.4 | 194.68,7.34 194.68,6.69 L39.4 | 197.66,7.34 197.66,6.69 L40.4 | 200.65,7.34 200.65,6.69 L41.4 | 203.63,7.34 203.63,6.69 L42.4 | 206.68,7.34 206.68,6.69 L43.4 | 209.66,7.34 209.66,6.69 L44.4 | 212.65,7.34 212.65,6.69 L45.4 | 215.63,7.34 215.63,6.69 L46.4
  Bottom 0.127: v146.35,2.06 145.46,2.06 FET_G2.3 | v148.96,4.66 148.96,5.42 v150.48,6.95
GREEN_S1
  Bottom 0.127: G_PDW1.1 104.38,1.37 105.52,1.37 105.84,1.05 FET_G1.1 105.9,1.05 108.64,1.05 109.48,1.89 111.83,1.89 112.32,2.38 112.32,7.71 114.74,10.13 122.17,10.13 123.37,11.33 124.38,11.33 124.57,11.14 124.7,11.14 NRF.40
GREEN_S2  (via drill 0.3 pad 0.5)
  Top 0.127: v114.98,3.81 116.18,5 125.19,5 126.59,3.61 v126.59,3.02 | v134.95,3.33 135.13,3.5 141.3,3.5 v142.75,2.06
  Bottom 0.127: G_PDW2.1 141.84,1.42 142.99,1.42 143.31,1.1 FET_G2.1 143.32,1.48 v142.75,2.06 | v114.98,3.81 115.34,4.16 115.34,8.44 116.27,9.37 122.96,9.37 123.84,10.25 NRF.37 | v126.59,3.02 126.87,3.3 133.25,3.3 133.85,2.69 134.31,2.69 v134.95,3.33
LED0  (via drill 0.3 pad 0.5)
  Top 0.127: v153.92,14.44 153.92,13.47 151.22,10.77 149.54,10.77 R24.1 | v77.29,10.74 76.45,9.9 R0.1
  Bottom 0.127: NRF.2 129.99,14.68 | v153.92,14.44 153.68,14.68 129.99,14.68 | 129.99,14.68 98.32,14.68 97.1,13.46 97.1,12.46 96.3,11.66 89.97,11.66 89.23,12.39 89.23,13.71 88.64,14.3 84.35,14.3 80.8,10.74 v77.29,10.74
LED1  (via drill 0.3 pad 0.5)
  Top 0.127: R1.1 81,11.22 92.3,11.22 95.76,14.68 152.72,14.68 v153.21,14.19 | R25.1 154.6,12.83 154.6,14.38 v154.66,14.44
  Bottom 0.127: NRF.3 130.31,14.43 152.97,14.43 v153.21,14.19 153.46,13.94 154.43,13.94 154.66,14.17 v154.66,14.44
LED2  (via drill 0.3 pad 0.5)
  Top 0.127: R2.1 83.74,10.97 92.42,10.97 95.88,14.43 151.98,14.43 v152.47,13.93 | v155.4,14.44 155.4,12.63 154.45,11.68 R26.1
  Bottom 0.127: NRF.4 130.62,14.18 152.23,14.18 v152.47,13.93 152.72,13.69 154.95,13.69 155.4,14.14 v155.4,14.44
LED3  (via drill 0.3 pad 0.5)
  Top 0.127: v151.74,13.68 151.24,14.18 96.01,14.18 92.51,10.68 86.45,10.68 R3.1 | v156.13,14.44 156.13,11.01 156.21,10.94 156.21,10.92 R27.1
  Bottom 0.127: NRF.5 130.93,13.92 151.5,13.92 v151.74,13.68 152,13.68 152.25,13.44 155.13,13.44 v156.13,14.44
LED4  (via drill 0.3 pad 0.5)
  Top 0.127: v151,13.43 150.51,13.92 96.14,13.92 92.64,10.42 89.19,10.42 R4.1 | R28.1 156.87,13.26 v156.87,14.44
  Bottom 0.127: NRF.6 131.24,13.67 150.76,13.67 v151,13.43 151.25,13.18 155.61,13.18 v156.87,14.44
LED5  (via drill 0.3 pad 0.5)
  Top 0.127: v150.26,13.17 149.77,13.67 96.25,13.67 92.75,10.17 91.94,10.17 R5.1 | v157.6,14.44 161.44,10.61 161.49,10.61 162.42,9.68 R29.1
  Bottom 0.127: NRF.7 131.55,13.41 150.02,13.41 v150.26,13.17 150.51,12.93 156.09,12.93 v157.6,14.44
LED6  (via drill 0.3 pad 0.5)
  Top 0.127: v149.53,12.92 149.03,13.41 96.38,13.41 94.45,11.48 R6.1 | v158.34,14.44 162.61,10.17 165.94,10.17 166.44,9.68 R30.1
  Bottom 0.127: NRF.8 131.86,13.16 149.29,13.16 v149.53,12.92 149.79,12.92 150.04,12.67 156.57,12.67 v158.34,14.44
LED7  (via drill 0.3 pad 0.5)
  Top 0.127: R7.1 100.93,13.16 126.69,13.16 126.74,13.16 148.3,13.16 v148.79,12.66 | v159.08,14.44 163.09,10.43 168.69,10.43 169.44,9.68 R31.1
  Bottom 0.127: NRF.9 132.18,12.9 148.55,12.9 v148.79,12.66 149.06,12.66 149.3,12.42 157.06,12.42 v159.08,14.44
LED8  (via drill 0.3 pad 0.5)
  Top 0.127: R8.1 103.68,12.9 147.56,12.9 v148.06,12.41 | v159.81,14.44 163.57,10.68 171.45,10.68 R32.1
  Bottom 0.127: NRF.10 132.49,12.65 147.81,12.65 v148.06,12.41 148.3,12.16 157.54,12.16 v159.81,14.44
LED9  (via drill 0.3 pad 0.5)
  Top 0.127: v147.32,12.15 146.82,12.65 106.42,12.65 R9.1 | v160.55,14.44 164.06,10.94 173.16,10.94 174.42,9.68 R33.1
  Bottom 0.127: NRF.11 132.8,12.4 147.08,12.4 v147.32,12.15 147.56,11.91 158.02,11.91 v160.55,14.44
LED10  (via drill 0.3 pad 0.5)
  Top 0.127: R10.1 107.08,10.31 108.03,10.31 110.11,12.4 146.09,12.4 v146.58,11.9 | v161.29,14.44 164.54,11.19 175.91,11.19 177.42,9.68 R34.1
  Bottom 0.127: NRF.12 133.11,12.14 146.34,12.14 v146.58,11.9 146.83,11.66 158.5,11.66 v161.29,14.44
LED11  (via drill 0.3 pad 0.5)
  Top 0.127: R11.1 109.45,10.16 110.03,10.74 115.34,10.74 116.74,12.14 145.35,12.14 v145.84,11.65 | v162.03,14.44 165.02,11.44 178.65,11.44 180.42,9.68 R35.1
  Bottom 0.127: NRF.14 131.31,8.47 131.51,8.47 134.92,11.89 145.6,11.89 v145.84,11.65 146.09,11.4 158.99,11.4 v162.03,14.44
LED12  (via drill 0.3 pad 0.5)
  Top 0.127: v145.11,11.39 145.05,11.39 144.55,11.89 117.07,11.89 115.65,10.46 113.24,10.46 R12.1 | v162.76,14.44 165.5,11.7 181.4,11.7 183.42,9.68 R36.1
  Bottom 0.127: NRF.15 131,8.22 131.61,8.22 135.03,11.63 144.87,11.63 v145.11,11.39 145.35,11.15 159.47,11.15 v162.76,14.44
LED13  (via drill 0.3 pad 0.5)
  Top 0.127: R13.1 117.41,11.63 143.88,11.63 v144.37,11.14 | v163.5,14.44 165.99,11.95 184.15,11.95 186.42,9.68 R37.1
  Bottom 0.127: NRF.16 130.69,7.96 131.74,7.96 135.16,11.38 144.13,11.38 v144.37,11.14 144.62,10.89 159.95,10.89 v163.5,14.44
LED14  (via drill 0.3 pad 0.5)
  Top 0.127: R14.1 120.15,11.38 143.14,11.38 v143.63,10.88 | v164.24,14.44 166.47,12.21 186.89,12.21 189.42,9.68 R38.1
  Bottom 0.127: NRF.17 130.37,7.71 131.85,7.71 135.26,11.13 143.39,11.13 v143.63,10.88 143.88,10.64 160.44,10.64 v164.24,14.44
LED15  (via drill 0.3 pad 0.5)
  Top 0.127: R15.1 122.9,11.13 142.4,11.13 v142.9,10.63 | v164.97,14.44 166.95,12.46 189.64,12.46 192.42,9.68 R39.1
  Bottom 0.127: NRF.18 130.06,7.46 131.95,7.46 135.37,10.87 142.66,10.87 v142.9,10.63 143.14,10.39 160.92,10.39 v164.97,14.44
LED16  (via drill 0.3 pad 0.5)
  Top 0.127: R16.1 125.65,10.87 141.01,10.87 v141.53,10.35 | v165.71,14.44 167.44,12.71 192.38,12.71 195.42,9.68 R40.1
  Bottom 0.127: NRF.19 129.75,7.2 132.06,7.2 135.47,10.62 141.26,10.62 v141.53,10.35 141.75,10.13 161.4,10.13 v165.71,14.44
LED17  (via drill 0.3 pad 0.5)
  Top 0.127: v138.51,10.09 137.98,10.62 128.39,10.62 R17.1 | v166.44,14.44 167.92,12.97 195.13,12.97 198.42,9.68 R41.1
  Bottom 0.127: NRF.20 129.44,6.95 132.16,6.95 135.58,10.36 138.24,10.36 v138.51,10.09 v138.52,10.09 138.91,9.7 141.58,9.7 141.75,9.88 161.88,9.88 v166.44,14.44
LED18  (via drill 0.3 pad 0.5)
  Top 0.127: R18.1 130.45,10.23 130.58,10.36 135.03,10.36 135.53,9.86 v135.53,9.57 | v130.66,5.46 130.66,5.54 130.81,5.69 202.24,5.69 v202.46,5.46 | R42.1 202.45,10.32 v202.44,10.34
  Bottom 0.127: NRF.21 129.16,6.66 130.66,6.66 | 130.66,6.66 132.25,6.66 135.16,9.57 v135.53,9.57 | 130.66,6.66 v130.66,5.46 | v202.44,10.34 202.44,5.49 v202.46,5.46
LED19  (via drill 0.3 pad 0.5)
  Top 0.127: v135.47,8.55 135.47,8.77 R19.1 | v131.51,5.19 131.76,5.43 201.53,5.43 202.13,4.84 204.78,4.84 v205.41,5.46 | R43.1 205.41,9.72 v205.41,10.44
  Bottom 0.127: NRF.22 130.3,4.95 130.95,4.95 131.27,5.27 | v135.47,8.55 134.55,8.55 131.27,5.27 | 131.27,5.27 131.43,5.27 v131.51,5.19 | v205.41,10.44 v205.41,5.46
LED20  (via drill 0.3 pad 0.5)
  Top 0.127: v138.49,8.14 138.24,8.39 138.24,8.95 137.55,9.64 R20.1 | v132.25,4.94 132.49,5.18 201.43,5.18 202.02,4.58 207.57,4.58 v208.46,5.46 | v208.46,10.41 R44.1
  Bottom 0.127: NRF.23 129.99,4.7 131.75,4.7 132.04,4.99 | v138.49,8.14 138.29,7.93 134.99,7.93 132.04,4.99 | 132.04,4.99 132.2,4.99 v132.25,4.94 | v208.46,5.46 v208.46,10.41
LED21  (via drill 0.3 pad 0.5)
  Top 0.127: v138.68,9.19 139.17,9.68 R21.1 | v167.18,14.44 168.4,13.22 195.88,13.22 206.88,13.22 210.42,9.68 R45.1
  Bottom 0.127: NRF.24 129.76,4.37 132.41,4.37 135.3,7.26 138.43,7.26 139.04,7.87 139.04,8.84 v138.68,9.19 141.73,9.19 142.16,9.62 162.37,9.62 v167.18,14.44
LED22  (via drill 0.3 pad 0.5)
  Top 0.127: R22.1 141.88,9.68 141.5,9.29 v141.5,8.23 | v167.92,14.44 168.88,13.48 209.62,13.48 213.42,9.68 R46.1
  Bottom 0.127: NRF.27 126.15,6.31 126.15,4.81 126.85,4.11 137.41,4.11 141.5,8.2 v141.5,8.23 142.65,9.37 162.85,9.37 v167.92,14.44
LED23  (via drill 0.3 pad 0.5)
  Top 0.127: R23.1 145.21,9.68 144.5,8.96 v144.5,8.18 | v168.65,14.44 169.37,13.73 213.4,13.73 R47.1
  Bottom 0.127: NRF.28 125.83,6.56 125.83,4.72 126.72,3.83 140.15,3.83 v144.5,8.18 145.44,9.12 163.33,9.12 v168.65,14.44
LED_R0
  Top 0.127: R0.2 77.52,9.68 77.52,9.55 76.38,8.41 L0.2
LED_R1
  Top 0.127: R1.2 80.5,9.68 80.5,9.49 79.42,8.41 L1.2
LED_R2
  Top 0.127: R2.2 83.49,9.68 83.49,9.49 82.41,8.41 L2.2
LED_R3
  Top 0.127: R3.2 86.54,9.68 86.54,9.55 85.39,8.41 L3.2
LED_R4
  Top 0.127: R4.2 89.52,9.68 89.52,9.55 88.38,8.41 L4.2
LED_R5
  Top 0.127: R5.2 92.5,9.68 92.5,9.49 91.42,8.41 L5.2
LED_R6
  Top 0.127: R6.2 95.49,9.68 95.49,9.49 94.41,8.41 L6.2
LED_R7
  Top 0.127: R7.2 98.54,9.68 98.54,9.55 97.39,8.41 L7.2
LED_R8
  Top 0.127: R8.2 101.52,9.68 101.52,9.55 100.38,8.41 L8.2
LED_R9
  Top 0.127: R9.2 104.51,9.68 104.51,9.49 103.43,8.41 L9.2
LED_R10
  Top 0.127: R10.2 107.49,9.68 107.49,9.49 106.41,8.41 L10.2
LED_R11
  Top 0.127: R11.2 110.54,9.55 109.4,8.41 L11.2
LED_R12
  Top 0.127: R12.2 113.52,9.68 113.52,9.55 112.38,8.41 L12.2
LED_R13
  Top 0.127: R13.2 116.51,9.68 116.51,9.55 115.36,8.41 L13.2
LED_R14
  Top 0.127: R14.2 119.49,9.68 119.49,9.49 118.41,8.41 L14.2
LED_R15
  Top 0.127: R15.2 122.54,9.55 121.4,8.41 L15.2
LED_R16
  Top 0.127: R16.2 125.53,9.68 125.53,9.55 124.38,8.41 L16.2
LED_R17
  Top 0.127: R17.2 128.51,9.68 128.51,9.55 127.37,8.41 L17.2
LED_R18
  Top 0.127: R18.2 131.49,9.68 131.49,9.49 130.41,8.41 L18.2
LED_R19
  Top 0.127: R19.2 133.45,8.44 L19.2
LED_R20
  Top 0.127: R20.2 136.45,8.43 L20.2
LED_R21
  Top 0.127: R21.2 139.37,8.49 L21.2
LED_R22
  Top 0.127: L22.2 142.42,8.41 143.5,9.49 143.5,9.68 R22.2 143.56,9.74 144,10.18 145.84,10.18 146.29,9.74 146.54,9.74 R23.2
LED_R24
  Top 0.127: R24.2 149.53,9.68 149.53,9.55 148.38,8.41 L24.2
LED_R25
  Top 0.127: R25.2 152.51,9.68 152.51,9.55 151.37,8.41 L25.2
LED_R26
  Top 0.127: R26.2 155.5,9.68 155.5,9.49 154.42,8.41 L26.2
LED_R27
  Top 0.127: R27.2 158.54,9.55 157.4,8.41 L27.2
LED_R28
  Top 0.127: R28.2 161.53,9.68 161.53,9.55 160.39,8.41 L28.2
LED_R29
  Top 0.127: R29.2 164.51,9.68 164.51,9.55 163.37,8.41 L29.2
LED_R30
  Top 0.127: R30.2 167.5,9.68 167.5,9.49 166.42,8.41 L30.2
LED_R31
  Top 0.127: R31.2 170.55,9.55 169.4,8.41 L31.2
LED_R32
  Top 0.127: R32.2 173.53,9.68 173.53,9.55 172.39,8.41 L32.2
LED_R33
  Top 0.127: R33.2 176.52,9.68 176.52,9.55 175.37,8.41 L33.2
LED_R34
  Top 0.127: R34.2 179.5,9.68 179.5,9.49 178.42,8.41 L34.2
LED_R35
  Top 0.127: R35.2 182.55,9.55 181.41,8.41 L35.2
LED_R36
  Top 0.127: R36.2 185.53,9.68 185.53,9.55 184.39,8.41 L36.2
LED_R37
  Top 0.127: R37.2 188.52,9.68 188.52,9.55 187.37,8.41 L37.2
LED_R38
  Top 0.127: R38.2 191.5,9.68 191.5,9.49 190.42,8.41 L38.2
LED_R39
  Top 0.127: R39.2 194.55,9.55 193.41,8.41 L39.2
LED_R42
  Top 0.127: R42.2 203.5,9.68 203.5,9.49 202.42,8.41 L42.2
LED_R43
  Top 0.127: R43.2 206.49,9.68 206.49,9.49 205.41,8.41 L43.2
LED_R44
  Top 0.127: R44.2 209.54,9.68 209.54,9.55 208.39,8.41 L44.2
LED_R45
  Top 0.127: R45.2 212.52,9.68 212.52,9.55 211.38,8.41 L45.2
LED_R46
  Top 0.127: R46.2 215.5,9.68 215.5,9.49 214.43,8.41 L46.2
LED_R47
  Top 0.127: R47.2 218.49,9.68 218.49,9.49 217.41,8.41 L47.2
MOTOR-
  Bottom 0.203: U$22.- 65.51,10.95 73.56,10.95 73.58,10.92 | FET_M.3 86.52,13.57 85.5,12.55 85.5,11.73 83.69,9.93 73.58,9.93 | U$11.+ 73.58,7.37 73.58,9.93 | M-.P$1 73.58,10.92 | 73.58,10.92 73.58,9.93
N$1
  Bottom 0.127: NRF.34 124.38,8.53 124.25,8.53 123.91,8.19 122.2,8.19 121.25,7.24 121.25,6.67 120.71,6.13 118.38,6.13 HFXO.3 116.26,6.87 C1.2
N$2
  Bottom 0.127: HFXO.1 118.79,8.22 118.86,8.15 120.38,8.15 C2.2 121.32,8.12 121.66,8.46 123.77,8.46 NRF.35
N$3
  Bottom 0.127: C7.2 122.1,6.95 123.43,6.95 124.7,8.22 NRF.33
N$4  (via drill 0.3)
  Top 0.127: v40.12,4.21 40.12,5.17 40.05,5.23 U$19.CC2
  Bottom 0.127: v40.12,4.21 41.45,2.88 CC2_PDN.2
N$5
  Top 0.127: PROG_R1.2 36.05,9.17 38.59,9.17 PROG_R2.1
N$6  (via drill 0.3)
  Top 0.203: CHRG_L.C 39.74,12.72 v41.64,10.82
  Bottom 0.127: TP4056.P$7 41.69,10.87 v41.64,10.82
N$7  (via drill 0.3)
  Top 0.203: STDBY_L.C 39.77,13.87 v41.92,11.72
  Bottom 0.127: TP4056.P$6 42.36,12.13 41.95,11.72 v41.92,11.72
N$8
  Bottom 0.127: NRF.46 126.41,12.85 126.22,13.04 122.12,13.04 120.85,11.77 C10.2
N$9  (via drill 0.3)
  Top 0.127: v38.85,4.21 38.85,5.1 38.97,5.23 U$19.CC1
  Bottom 0.127: v38.85,4.21 37.51,2.88 CC1_PDN.2
N$10
  Bottom 0.127: 124.25,5.55 L.1
  Bottom 0.203: NRF.30 124.25,6.12 124.25,5.55 | C3.1 124.87,4.85 L.1
N$11
  Bottom 0.127: C4.1 120.89,13.87 127.62,13.87 128.06,13.42 NRF.1
N$12
  Bottom 0.127: M_PUP.1 85.68,9.25 FET_M1.3 87.55,10.52 FET_M.1
N$13
  Bottom 0.203: U$22.+ 53.1,1.44 60.47,1.44 63.21,4.17 66.89,4.17 70.07,1 MOTOR_JMP.1
N$14  (via drill 0.3)
  Top 0.127: v39.61,10.82 39.61,11.25 39.11,11.75 37.93,11.75 37.07,10.88 36.05,10.88 PROG_R1.1
  Bottom 0.127: v39.61,10.82 37.77,10.82 TP4056.P$2
N$16
  Top 0.127: STDBY_L.A SB_R.2
N$17
  Top 0.127: CHRG_L.A CH_R.2
N$18
  Bottom 0.254: L.2 122.65,3.95 C13.1 122.77,3.95 C6.1
N$19
  Bottom 0.254: C13.2 119.2,3.95 ANT.P1
N$30
  Bottom 0.127: R_PWR_L.2 81.34,1.63 PWR_L.A
RED1  (via drill 0.3)
  Top 0.127: L23.3 145.9,7.62 143.62,7.62 | L0.3 78.37,7.62 80.63,7.62 | 143.62,7.62 140.64,7.62 | 140.64,7.62 137.65,7.62 | 137.65,7.62 134.67,7.62 | 134.67,7.62 131.62,7.62 | 131.62,7.62 128.64,7.62 | 128.64,7.62 125.65,7.62 | 125.65,7.62 122.67,7.62 | 122.67,7.62 119.62,7.62 | 119.62,7.62 116.64,7.62 | 116.64,7.62 114.51,7.62 | 113.65,7.62 110.67,7.62 | 114.51,7.62 113.65,7.62 | 110.67,7.62 107.62,7.62 | 107.62,7.62 104.63,7.62 | 104.63,7.62 101.65,7.62 | 101.65,7.62 98.67,7.62 | 98.67,7.62 95.62,7.62 | 95.62,7.62 92.63,7.62 | 92.63,7.62 89.65,7.62 | 89.65,7.62 86.66,7.62 | 86.66,7.62 83.68,7.62 | 83.68,7.62 80.63,7.62 | 114.51,7.62 v114.51,8.03 | 80.63,7.62 L1.3 | 83.68,7.62 83.68,8.34 L2.3 | 86.66,7.62 86.66,8.34 L3.3 | 89.65,7.62 L4.3 | 92.63,7.62 L5.3 | 95.62,7.62 95.62,8.34 L6.3 | 98.67,7.62 98.67,8.34 L7.3 | 101.65,7.62 L8.3 | 104.63,7.62 L9.3 | 107.62,7.62 107.62,8.34 L10.3 | 110.67,7.62 110.67,8.34 L11.3 | 113.65,7.62 L12.3 | 116.64,7.62 L13.3 | 119.62,7.62 119.62,8.34 L14.3 | 122.67,7.62 122.67,8.34 L15.3 | 125.65,7.62 125.65,8.34 L16.3 | 128.64,7.62 L17.3 | 131.62,7.62 L18.3 | 134.67,7.62 134.67,8.34 L19.3 | 137.65,7.62 137.65,8.34 L20.3 | 140.64,7.62 L21.3 | 143.62,7.62 L22.3
  Bottom 0.127: v114.51,8.03 113.47,6.98 FET_R1.3
RED2  (via drill 0.3)
  Top 0.127: L47.3 217.88,7.6 215.63,7.6 | 152.64,7.6 150.39,7.6 L24.3 149.59,8.34 148.89,7.64 148.13,7.64 v147.5,7.01 | 152.64,7.6 155.62,7.6 | 155.62,7.6 158.67,7.6 | 158.67,7.6 161.66,7.6 | 161.66,7.6 164.64,7.6 | 164.64,7.6 167.62,7.6 | 167.62,7.6 170.67,7.6 | 170.67,7.6 173.66,7.6 | 173.66,7.6 176.64,7.6 | 176.64,7.6 179.63,7.6 | 179.63,7.6 182.68,7.6 | 182.68,7.6 185.66,7.6 | 185.66,7.6 188.64,7.6 | 188.64,7.6 191.63,7.6 | 191.63,7.6 194.68,7.6 | 194.68,7.6 197.66,7.6 | 197.66,7.6 200.65,7.6 | 200.65,7.6 203.63,7.6 | 203.63,7.6 206.68,7.6 | 206.68,7.6 209.66,7.6 | 209.66,7.6 212.65,7.6 | 212.65,7.6 215.63,7.6 | 152.64,7.6 L25.3 | 155.62,7.6 L26.3 | 158.67,7.6 158.67,8.34 L27.3 | 161.66,7.6 161.66,8.34 L28.3 | 164.64,7.6 L29.3 | 167.62,7.6 L30.3 | 170.67,7.6 170.67,8.34 L31.3 | 173.66,7.6 173.66,8.34 L32.3 | 176.64,7.6 176.64,8.34 L33.3 | 179.63,7.6 L34.3 | 182.68,7.6 182.68,8.34 L35.3 | 185.66,7.6 185.66,8.34 L36.3 | 188.64,7.6 188.64,8.34 L37.3 | 191.63,7.6 L38.3 | 194.68,7.6 194.68,8.34 L39.3 | 197.66,7.6 197.66,8.34 L40.3 | 200.65,7.6 200.65,8.34 L41.3 | 203.63,7.6 L42.3 | 206.68,7.6 206.68,8.34 L43.3 | 209.66,7.6 209.66,8.34 L44.3 | 212.65,7.6 212.65,8.34 L45.3 | 215.63,7.6 L46.3
  Bottom 0.127: v147.5,7.01 145.34,7.01 140.38,2.06 139.43,2.06 FET_R2.3
RED_S1
  Bottom 0.127: R_PDW1.1 109.9,1.37 110.98,1.37 111.36,0.99 FET_R1.1 112.76,2.35 112.76,7.47 115.17,9.88 122.3,9.88 123.49,11.07 124.06,11.07 124.25,10.88 124.38,10.88 NRF.39
RED_S2  (via drill 0.3)
  Top 0.127: v135.11,2.06 135.11,2.13 v134.06,3.19
  Bottom 0.127: FET_R2.1 137.27,1.1 136.96,1.42 135.88,1.42 R_PDW2.1 135.24,2.06 v135.11,2.06 | v134.06,3.19 133.68,3.57 126.59,3.57 125.23,4.93 125.23,6.4 125.84,7.01 NRF.29
SENSOR||SDA  (via drill 0.3 pad 0.5)
  Top 0.127: HALL.OUT 90.84,13.5 91.51,12.83 v93.01,12.83 | v96.11,12.34 96.58,11.88 v96.58,10.19 | v75.92,11.3 74.5,12.72 67.92,12.72 S1.P$2 64.95,9.75 S2.2 61.25,10.58 59.93,11.9 56,11.9 54.75,10.66 S2.1 51.05,9.75 S1.P$1
  Bottom 0.127: NRF.42 125.27,11.71 125.25,11.71 125.06,11.9 123.2,11.9 121.99,10.69 106.91,10.69 | v93.01,12.83 94.53,12.83 BUTTON.1 95.93,12.52 v96.11,12.34 | 106.91,10.69 105.33,10.69 105.15,10.51 102.75,10.51 MPU6050.24 102.73,10.5 102.73,9.68 102.03,8.98 99.03,8.98 97.81,10.19 v96.58,10.19 | IPUP1.2 106.86,10.74 106.91,10.69 | v75.92,11.3 77.98,11.3 79.27,12.6 HALL.OUT
SHIELD
  Top 0.127: U$19.SHIELD2 35.16,5.23 35.16,1.61 U$19.SHIELD1 35.23,1.55 43.8,1.55 U$19.SHIELD4 43.86,1.61 43.86,5.23 U$19.SHIELD3
SWDCLK  (via drill 0.3 pad 0.5)
  Top 0.127: v127.62,5.01 129.77,2.85 U$2.SWDCLK
  Bottom 0.127: NRF.25 126.96,5.99 126.96,5.67 v127.62,5.01
SWDIO  (via drill 0.3 pad 0.5)
  Top 0.127: v126.82,4.98 128.5,3.29 U$2.SWDIO
  Bottom 0.127: NRF.26 126.44,6.04 126.44,5.36 v126.82,4.98
USB_VIN  (via drill 0.3, 0.3 pad 0.5)
  Top 0.203: 39.61,6.12 40.44,6.12 40.94,5.61 40.94,5.29 U$19.VBUS2 41,6.34 42.19,7.54 v43.94,7.54 | 39.61,6.12 38.59,6.12 38.02,5.55 38.02,5.29 U$19.VBUS1 | v96.5,4.23 80.48,4.23 79.79,4.91 71.54,4.91 70.13,6.32 v70.1,6.32 | 39.61,6.12 v39.61,6.31
  Bottom 0.203: v96.5,4.23 95.74,4.23 U$16.3 | v39.61,6.31 40.88,6.31 R_USB_VIN.2 | v70.1,6.32 69.17,5.4 63.48,5.4 61.07,2.98 55.31,2.98 52.41,5.89 45.59,5.89 v43.94,7.54
VIN_SW  (via drill 0.3)
  Top 0.203: v72.19,5.55 71.55,6.18 v71.55,11.71
  Bottom 0.203: MOTOR_JMP.2 73.24,1.31 73.24,3.21 U$11.- 73.13,3.59 72.19,4.53 v72.19,5.55 74.55,5.55 75.27,6.27 83.8,6.27 | M+.P$1 v71.55,11.71 | 93.22,4.79 93.19,4.79 92.98,5 REG.3 | 93.22,4.79 94.44,4.79 94.88,5.23 REG.1 | 93.22,4.79 91.86,3.43 U$16.2 91.86,3.82 91.08,4.6 90.59,4.6 | 83.8,6.27 M_PUP.2 | 83.8,6.27 85.48,4.6 90.59,4.6 | 90.59,4.6 V_DIV_H.1

## Text on the board
tNames: BAT | BAT | BAT | USB | GND | GND | BLE_POV_DISPLAY_v2.1
bNames: BAT | GND